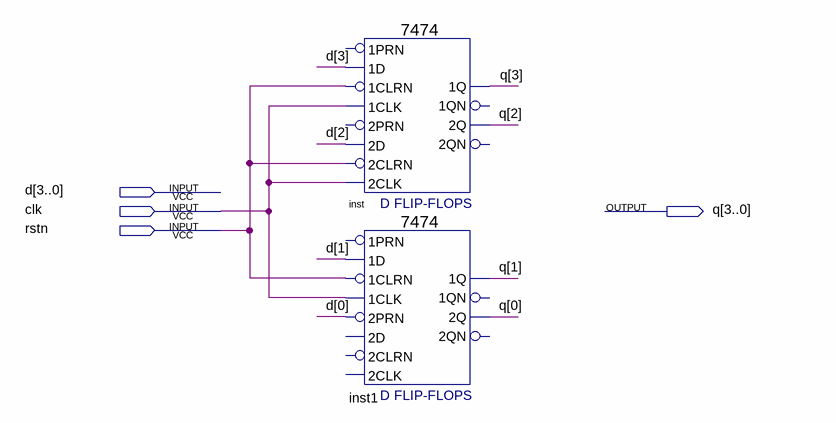
[diagram p0: schematic sheet]
// Quartus schematic reg4.bdf as structural Verilog: 2 symbols, 4 pins
module reg4 (
  input  [3:0] d,
  input  clk,
  input  rstn,
  output [3:0] q
);

  \7474  inst (
    .\2D (d[2]), .\1CLK (clk), .\1D (d[3]), .\2CLK (clk), .\2CLRN (rstn), .\1CLRN (rstn), .\2Q (q[2]),
    .\1Q (q[3]));  // open: 2PRN, 1PRN, 1QN, 2QN
  \7474  inst1 (
    .\2PRN (d[0]), .\1CLK (clk), .\1D (d[1]), .\1CLRN (rstn), .\2Q (q[0]), .\1Q (q[1]));  // open: 2D, 1PRN, 2CLK, 2CLRN, 1QN, 2QN
endmodule
